# Altium schematic sheet seccionamento.SchDoc: Seccionamento
size A4; Author: Matheus Gois Vieira; Organization: UnB; Address1: Faculdade do Gama
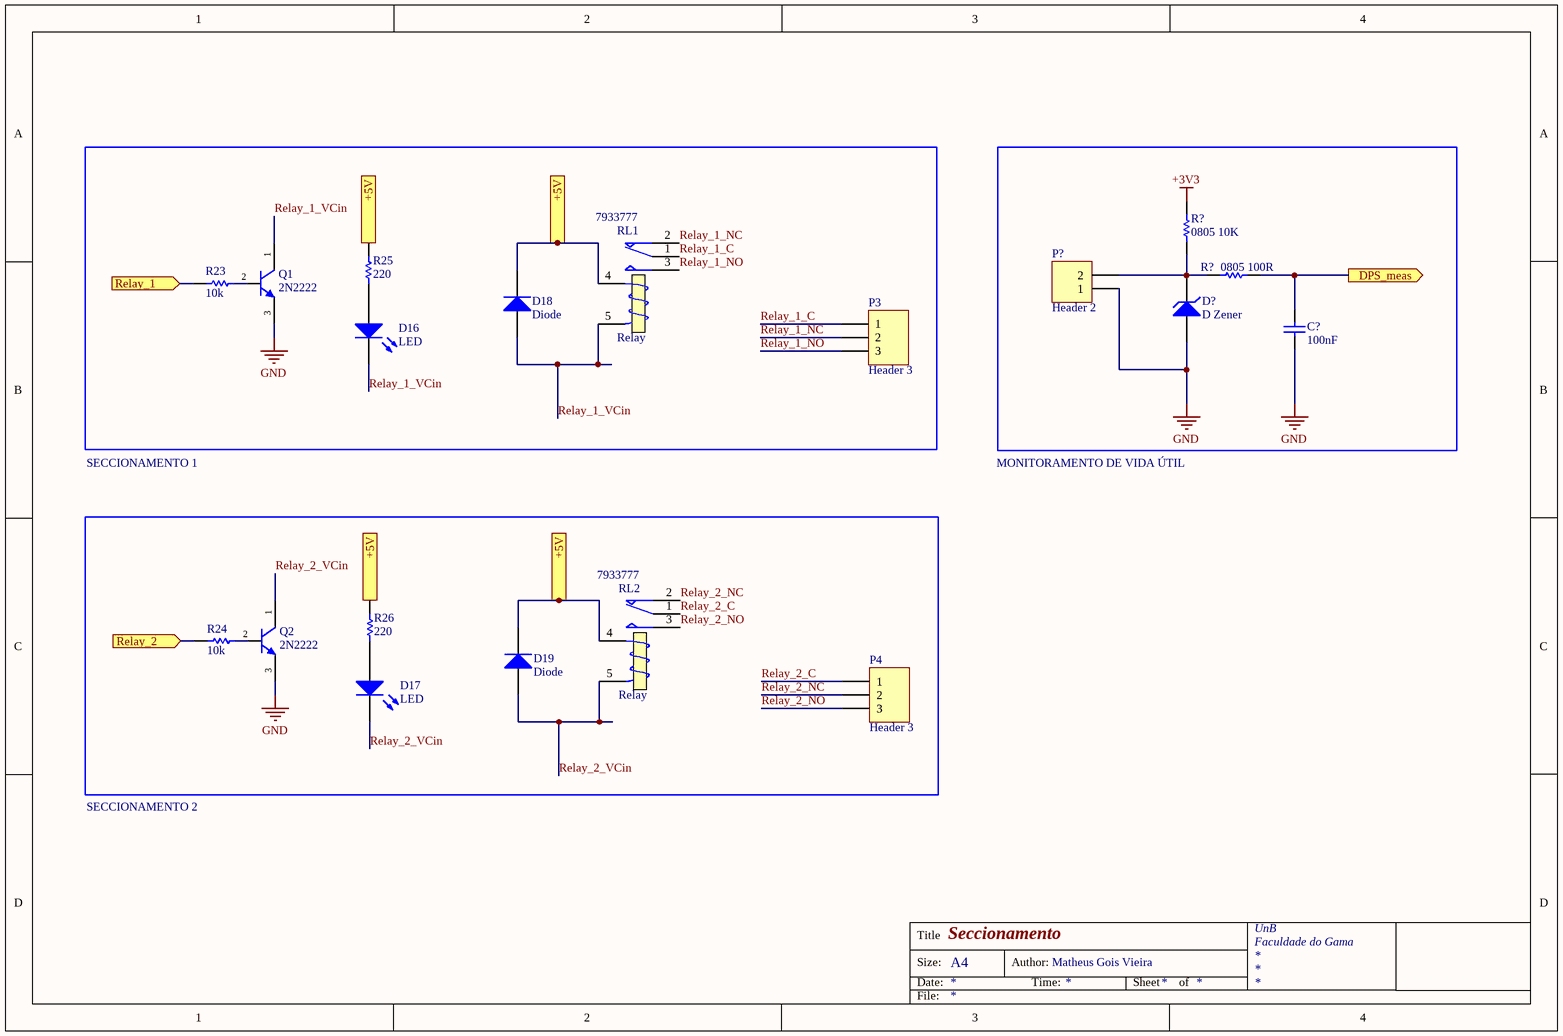
[diagram p0: seccionamento.SchDoc]

## Parts
(Parts that share a designator on the sheet are numbered #1, #2 ... from top to bottom, then left to right.)
C?  100nF  [0603]
D16  LED  [LED-0603-G]
D17  LED  [LED-0603-G]
D18  Diode  [SMC]
D19  Diode  [SMC]
D?  D Zener  [DIODE-SIGNAL]
P3  Header 3  [HDR1X3]
P4  Header 3  [HDR1X3]
P?  Header 2  [HDR1X2]
Q1  2N2222  [TO-220]
Q2  2N2222  [TO-220]
R23  10k  [R1608[0603]]
R24  10k  [R1608[0603]]
R25  220  [R1608[0603]]
R26  220  [R1608[0603]]
R?#1  0805 10K  [RES0805]
R?#2  0805 100R  [RES0805]
RL1  Relay  Supplier Part Number 1: 7933777  [FINDER-36.11]
RL2  Relay  Supplier Part Number 1: 7933777  [FINDER-36.11]

## Ports
+5V (in), DPS_meas (out), Relay_1 (in), Relay_2 (in)

## Nets
+3V3: R?#1.2
GND: C?.2 D?.1(A) P?.1 Q1.3(E) Q2.3(E)
+5V: D18.2(K) D19.2(K) R25.2 R26.2 RL1.4(T1) RL2.4(T1) ; port +5V
DPS_meas: C?.1 R?#2.2 ; port DPS_meas
Relay_1: R23.1 ; port Relay_1
Relay_1_C: P3.1 RL1.1(COM)
Relay_1_NC: P3.2 RL1.2(NC)
Relay_1_NO: P3.3 RL1.3(NO)
Relay_1_VCin: D16.2(K) D18.1(A) Q1.1(C) RL1.5(T2)
Relay_2: R24.1 ; port Relay_2
Relay_2_C: P4.1 RL2.1(COM)
Relay_2_NC: P4.2 RL2.2(NC)
Relay_2_NO: P4.3 RL2.3(NO)
Relay_2_VCin: D17.2(K) D19.1(A) Q2.1(C) RL2.5(T2)
NetD16_1: D16.1(A) R25.1
NetD17_1: D17.1(A) R26.1
NetD?_2: D?.2(K) P?.2 R?#1.1 R?#2.1
NetQ1_2: Q1.2(B) R23.2
NetQ2_2: Q2.2(B) R24.2

## Notes on the sheet
- SECCIONAMENTO 1
- MONITORAMENTO DE VIDA ÚTIL
- SECCIONAMENTO 2
- Title
- Size:
- Date:
- A4
- Author:
- Time:
- Sheet
- of
- File:

## Library data of the parts
C? = CAP CER SMD-0603 100nF - 50V: Capacitor Ceramic 100nF 20% 50V 0603 (1608 Metric) X7R; MPN: C0603C104M5RACTU; Manufacturer: KEMET; CDI: 018177; Op_Temperature: -55 C to +125 C; Type: Capacitor Ceramic; Value: 100nF; Tolerance: 20%; Package: Tape & Reel; RoHS: SIM; Voltage: 50V; Case: 0603 (1608 Metric); Temp_Coefficient: X7R; NCM: *; CDI_Alternate: *; MPN_Alternate: *; Manufacturer_Alternate: *; Price (und.): 0,10000; Price (10k): 0.00741; Supplier 1: RSComponents; Supplier Part Number 1: 6698842
D16 D17 = LED: 0603(H=0.9mm) 绿色 λD=569nm VR=5V VF=2.1V~2.6V IF=20mA PD=100mW; Manufacturer Part Number: LTST-C190GKT; Color: Green; Lens Color: Colorless; Luminous Intensity: 6mcd; Forward Voltage: 2.1V; Viewing Angle: 130°; Lens Style: Clear,Diffused,Colorless,Rectangular; Forward Current: 30mA; Dominant Wavelength: 569nm; Test Current: 10mA; Wavelength: 565nm; Number of LEDs: 1; Power Dissipation: 100mW; Reverse Voltage: 5V; Lens Transparency: Clear; Voltage: 2V; Manufacturer: *; PartNumber: *; Package Type: *; Supplier 1: RSComponents; Supplier Part Number 1: 6920975P; RoHS: Yes; Category: LEDs; Stock 1: 30970; Pricing 1: 250=0,05500, 500=0,05200, 1250=0,03300, 2500=0,03100 (GBP); Mount: Surface Mount; Case/Package: 0603; Number of Pins: 2; Case Code (Metric): 1608; Case Code (Imperial): 0603; Min Operating Temperature: -55°C; Max Operating Temperature: 85°C; Packaging: Tape and Reel; Package Quantity: 1; Illumination Color: Green; Number of Elements: 1; Power Rating: 100mW; Length: 1.6mm; Width: 0.8mm; Height: 0.8mm; Depth: 0.8mm; Radiation Hardening: No; RoHS Compliant: Yes; Lead Free: Lead Free; ComponentLink1URL: https://datasheet.ciiva.com/2109/ltst-c190gkt-2109985.pdf?src-supplier=Digi-Key; ComponentLink1Description: https://datasheet.ciiva.com/2109/ltst-c190gkt-2109985.pdf?src-supplier=Digi-Key; ComponentLink2URL: https://datasheet.ciiva.com/11775/0900766b80dc02a6-11775616.pdf?src-supplier=RSComponents; ComponentLink2Description: https://datasheet.ciiva.com/11775/0900766b80dc02a6-11775616.pdf?src-supplier=RSComponents; ComponentLink3URL: https://datasheet.ciiva.com/12403/lite-on-ltst-c190gkt-187204-12403884.pdf?src-supplier=Mouser; ComponentLink3Description: https://datasheet.ciiva.com/12403/lite-on-ltst-c190gkt-187204-12403884.pdf?src-supplier=Mouser; ComponentLink4URL: https://datasheet.ciiva.com/16392/lite-on20ltst-c190gkt-16392818.pdf?src-supplier=Future+Electronics; ComponentLink4Description: https://datasheet.ciiva.com/16392/lite-on20ltst-c190gkt-16392818.pdf?src-supplier=Future+Electronics; ComponentLink5URL: https://datasheet.ciiva.com/2109/ltst-c190gkt-2109986.pdf?src-supplier=Digi-Key; ComponentLink5Description: https://datasheet.ciiva.com/2109/ltst-c190gkt-2109986.pdf?src-supplier=Digi-Key; ComponentLink6URL: https://datasheet.ciiva.com/2109/ltst-c190gkt-2109987.pdf?src-supplier=Digi-Key; ComponentLink6Description: https://datasheet.ciiva.com/2109/ltst-c190gkt-2109987.pdf?src-supplier=Digi-Key
D18 D19 = Diode: VR=100V IF=200mA; Manufacturer: ON Semiconductor / Fairchild; Manufacturer Part Number: FDLL4148; Polarity: Standard; Max Reverse Current: 5uA; Max Repetitive Reverse Voltage (Vrrm): 100V; Element Configuration: Single; Current Rating: 200mA; Forward Voltage: 1V; Max Forward Surge Current (Ifsm): 4A; Capacitance: 4pF; Power Dissipation: 500mW; Recovery Time: 4ns; Published: 8-Jun-2000; LatestRevisionDate: 17-Jul-2002; LatestRevisionNote: Re-released for DXP Platform.; PackageVersion: Sep-1996; PackageReference: SMC; Publisher: Altium Limited; PackageDescription: DO-214-AB/SMC; 2 C-Bend Leads; Body 7.9 x 5.9 mm, inc. leads (LxW); Code_JEDEC: DO-214-AB; Supplier 1: RSComponents; Supplier Part Number 1: 6708823; RoHS: Yes; Category: Rectifier Diodes; Stock 1: 2100; Pricing 1: 25=0,09200, 500=0,08700, 625=0,08300, 1250=0,07800, 2500=0,07500 (GBP); Mount: Surface Mount; Number of Pins: 34; Weight: 0.05184g; Contact Plating: Tin,Matte; Min Operating Temperature: -65°C; Max Operating Temperature: 175°C; Packaging: Tape and Reel; Package Quantity: 1; Voltage Rating (DC): 100V; Peak Non-Repetitive Surge Current: 4A; Output Current: 200mA; Max Surge Current: 4A; Average Rectified Current: 200mA; Max Reverse Voltage (DC): 100V; Forward Current: 200mA; Reverse Voltage: 100V; Reverse Recovery Time: 4ns; Length: 3.6mm; Width: 1.5mm; Height: 1.5mm; Radiation Hardening: No; RoHS Compliant: Yes; Lead Free: Lead Free; REACH SVHC: No SVHC; ComponentLink1URL: https://datasheet.ciiva.com/34301/785354-34301524.pdf?src-supplier=Jameco; ComponentLink1Description: https://datasheet.ciiva.com/34301/785354-34301524.pdf?src-supplier=Jameco; ComponentLink2URL: https://datasheet.ciiva.com/8053/30071-8053638.pdf?src-supplier=Element14; ComponentLink2Description: https://datasheet.ciiva.com/8053/30071-8053638.pdf?src-supplier=Element14; ComponentLink3URL: https://datasheet.ciiva.com/22714/1716967-22714318.pdf?src-supplier=Element14; ComponentLink3Description: https://datasheet.ciiva.com/22714/1716967-22714318.pdf?src-supplier=Element14; ComponentLink4URL: https://datasheet.ciiva.com/1181/1716967-1181018.pdf?src-supplier=Element14; ComponentLink4Description: https://datasheet.ciiva.com/1181/1716967-1181018.pdf?src-supplier=Element14; ComponentLink5URL: https://datasheet.ciiva.com/1180/1716967-1180972.pdf?src-supplier=Element14; ComponentLink5Description: https://datasheet.ciiva.com/1180/1716967-1180972.pdf?src-supplier=Element14; ComponentLink6URL: https://datasheet.ciiva.com/910/fdll4148-910350.pdf?src-supplier=Digi-Key; ComponentLink6Description: https://datasheet.ciiva.com/910/fdll4148-910350.pdf?src-supplier=Digi-Key; ComponentLink7URL: https://datasheet.ciiva.com/910/fdll4148-910351.pdf?src-supplier=Digi-Key; ComponentLink7Description: https://datasheet.ciiva.com/910/fdll4148-910351.pdf?src-supplier=Digi-Key; ComponentLink8URL: https://datasheet.ciiva.com/910/fdll4148-910349.pdf?src-supplier=Digi-Key; ComponentLink8Description: https://datasheet.ciiva.com/910/fdll4148-910349.pdf?src-supplier=Digi-Key
D? = D Zener: Diode Zener Single 9.1V 5% 500mW 2-Pin(1+Tab) Power Mite T/R; Manufacturer Part Number: 1PMT5924BT1G; Test Current: 41.2mA; Max Power Dissipation: 3.2W; Impedance: 4R; Max Reverse Leakage Current: 5uA; Voltage Rating (DC): 6.2V; ESD Protection: Yes; Manufacturer: *; PartNumber: *; Package Type: *; Supplier 1: Newark; Supplier Part Number 1: 70K6994; RoHS: Yes; Category: Zener Diodes; Pricing 1: 1=0,25500, 3000=0,25500, 9000=0,23200, 24000=0,21400, 45000=0,20000 (USD); Case/Package: DO-216AA; Number of Pins: 2; Contact Plating: Tin,Matte; Min Operating Temperature: -55°C; Max Operating Temperature: 150°C; Packaging: Tape and Reel; Zener Voltage: 9.1V; Voltage Tolerance: 5%; Power Dissipation: 500mW; Element Configuration: Single; Package Quantity: 1; Tolerance: 5%; Power Rating: 3.2W; Breakdown Voltage: 6.2V; Length: 2.18mm; Width: 2.05mm; Height: 1.15mm; Radiation Hardening: No; Lead Free: Lead Free; RoHS Compliant: Yes; Halogen Free: Halogen Free; ComponentLink1URL: https://datasheet.ciiva.com/4735/1pmt5920b-d-40129-4735077.pdf?src-supplier=Mouser; ComponentLink1Description: https://datasheet.ciiva.com/4735/1pmt5920b-d-40129-4735077.pdf?src-supplier=Mouser; ComponentLink2URL: https://datasheet.ciiva.com/26092/1pmt5920b-d-26092383.pdf?src-supplier=Avnet+Europe; ComponentLink2Description: https://datasheet.ciiva.com/26092/1pmt5920b-d-26092383.pdf?src-supplier=Avnet+Europe; ComponentLink3URL: https://datasheet.ciiva.com/10638/1pmt5920b-d-10638985.pdf?src-supplier=Avnet; ComponentLink3Description: https://datasheet.ciiva.com/10638/1pmt5920b-d-10638985.pdf?src-supplier=Avnet
P3 P4 = Header 3: Conn Terminal Block 3 POS 5mm Solder ST Thru-Hole 15A Bulk; Manufacturer: Lumberg; Manufacturer Part Number: KRESS03; Max Supply Voltage (AC): 250V; Number of Poles: 3; Approvals: UL,CSA,VDE; LatestRevisionDate: 17-Jul-2002; LatestRevisionNote: Re-released for DXP Platform.; Publisher: Altium Limited; Supplier 1: RSComponents; Supplier Part Number 1: 2508732301; RoHS: Yes; Category: Connectors; Housing Material: Polyamide; Min Operating Temperature: -25°C; Max Operating Temperature: 100°C; Packaging: Bulk; Number of Rows: 1; Max Current Rating: 15A; Termination: Solder; Orientation: Straight; Current Rating: 15A; Voltage Rating: 250V; Length: 15mm; Depth: 8.3mm; RoHS Compliant: Yes; ComponentLink1URL: https://www.alliedelec.com/m/d/febd0e8d7554432b76be7d34941e766f.pdf?src-supplier=Allied+Electronics; ComponentLink1Description: https://www.alliedelec.com/m/d/febd0e8d7554432b76be7d34941e766f.pdf?src-supplier=Allied+Electronics; ComponentLink2URL: http://components.arrow.com/part/dataview/0323_01039480?src-supplier=Arrow+Europe; ComponentLink2Description: http://components.arrow.com/part/dataview/0323_01039480?src-supplier=Arrow+Europe
P? = Header 2: 间距5.08mm 2pin 母座 12A 320V 弯插 封边; Manufacturer: Phoenix Contact; Manufacturer Part Number: 1757242; Number of Positions: 2; Voltage Rating: 250V; Connector Type: Plug; Gender: Male; Number of Levels: 1; Current: 15A; Voltage: 300V; Pitch: 5.08mm; Approvals: UL,CSA,VDE,EN; LatestRevisionDate: 17-Jul-2002; LatestRevisionNote: Re-released for DXP Platform.; Publisher: Altium Limited; Supplier 1: RSComponents; Supplier Part Number 1: 1896105; RoHS: Yes; Category: Terminal Blocks; Stock 1: 1395; Pricing 1: 5=0,48800, 75=0,44200, 250=0,40400, 500=0,36600, 1000=0,34200 (GBP); Mount: Through Hole; Contact Plating: Tin; Color: Grey,Green; Housing Material: PBT; Contact Material: Tin; Housing Color: Green; Weight: 5.396916oz; Number of Rows: 1; Package Quantity: 50; Packaging: Bulk; Termination: Solder; Number of Contacts: 2; Orientation: Right Angle; Series: MSTBA; Current Rating: 12A; Voltage Rating (DC): 320V; Max Current Rating: 12A; Number of Poles: 2; Number of Positions Per Level: 2; Length: 12.16mm; Width: 12.1mm; Height: 12.08mm; Depth: 12mm; Flammability Rating: UL94 V-0; RoHS Compliant: Yes; REACH SVHC: No SVHC; Lead Free: Lead Free; ComponentLink1URL: https://datasheet.ciiva.com/16096/1757242-16096402.pdf?src-supplier=Onlinecomponents.com; ComponentLink1Description: https://datasheet.ciiva.com/16096/1757242-16096402.pdf?src-supplier=Onlinecomponents.com; ComponentLink2URL: https://datasheet.ciiva.com/15197/getdatasheetpartid-176350-15197328.pdf?src-supplier=Verical; ComponentLink2Description: https://datasheet.ciiva.com/15197/getdatasheetpartid-176350-15197328.pdf?src-supplier=Verical; ComponentLink3URL: https://datasheet.ciiva.com/795/1757242-795407.pdf?src-supplier=Digi-Key; ComponentLink3Description: https://datasheet.ciiva.com/795/1757242-795407.pdf?src-supplier=Digi-Key; ComponentLink4URL: https://datasheet.ciiva.com/29210/569017-da-01-en-grundgehaeuse-1757242-250-st-29210285.pdf?src-supplier=Conrad; ComponentLink4Description: https://datasheet.ciiva.com/29210/569017-da-01-en-grundgehaeuse-1757242-250-st-29210285.pdf?src-supplier=Conrad; ComponentLink5URL: https://datasheet.ciiva.com/7630/100955-7630839.pdf?src-supplier=Element14; ComponentLink5Description: https://datasheet.ciiva.com/7630/100955-7630839.pdf?src-supplier=Element14; ComponentLink6URL: https://datasheet.ciiva.com/33105/1757242-33105868.pdf?src-supplier=Today+Components; ComponentLink6Description: https://datasheet.ciiva.com/33105/1757242-33105868.pdf?src-supplier=Today+Components
Q1 Q2 = NPN: NPN Bipolar Transistor; Manufacturer: *; PartNumber: *; Package Type: *
R23 R24 = R: Res, 10K, 0.01%, 0.25W, 1206, Metal Foil; Manufacturer Part Number: Y163010K0000T9R; Value: 0; Resistance: 10kR; Max Power Dissipation: 250mW; Temperature Coefficient: 0.2ppm/°C; Manufacturer: *; PartNumber: *; Package Type: *; Supplier 1: Digi-Key; Supplier Part Number 1: Y1630-10.0KBCT-ND; RoHS: Yes; Category: Chip SMD Resistors; Stock 1: 1437; Pricing 1: 1=11,40000, 10=10,36300, 25=9,32640, 50=8,03100, 100=7,38340 (USD); Case/Package: 1206; Case Code (Metric): 3216; Case Code (Imperial): 1206; Min Operating Temperature: -55°C; Max Operating Temperature: 150°C; Package Quantity: 1; Packaging: Tape and Reel; Tolerance: 0.01%; Resistor Type: Metal Foil; Number of Terminations: 2; Features: Moisture Resistant,Anti-Sulfur; Length: 0.126inch; Width: 0.062inch; Height: 0.025inch; RoHS Compliant: Yes; ComponentLink1URL: https://datasheet.ciiva.com/29711/vfcpseri-29711161.pdf?src-supplier=Digi-Key; ComponentLink1Description: https://datasheet.ciiva.com/29711/vfcpseri-29711161.pdf?src-supplier=Digi-Key; ComponentLink2URL: https://datasheet.ciiva.com/29711/vfcpseri-29711162.pdf?src-supplier=Digi-Key; ComponentLink2Description: https://datasheet.ciiva.com/29711/vfcpseri-29711162.pdf?src-supplier=Digi-Key; ComponentLink3URL: https://datasheet.ciiva.com/18610/vfcpseri-18610015.pdf?src-supplier=Digi-Key; ComponentLink3Description: https://datasheet.ciiva.com/18610/vfcpseri-18610015.pdf?src-supplier=Digi-Key
R25 R26 = R: Res Thick Film 0603 220 Ohm 1% 1/10W ±100ppm/°C Molded SMD Paper T/R; Manufacturer Part Number: Y163010K0000T9R; Value: 0; Resistance: 10kR; Tolerance: 0.01%; Max Power Dissipation: 250mW; Temperature Coefficient: 0.2ppm/°C; Power Rating: 100mW; Voltage Rating: 50V; Manufacturer: *; PartNumber: *; Package Type: *; RoHS: Yes; Category: Chip SMD Resistors; Stock 1: 11812; Pricing 1: 10=0,01500, 25=0,01200, 50=0,00900, 100=0,00600 (USD); Case/Package: 1206; Case Code (Metric): 3216; Case Code (Imperial): 1206; Min Operating Temperature: -55°C; Max Operating Temperature: 150°C; Package Quantity: 1; Packaging: Tape and Reel; Resistor Type: Metal Foil; Number of Terminations: 2; Features: Moisture Resistant,Anti-Sulfur; Length: 0.126inch; Width: 0.062inch; Height: 0.025inch; RoHS Compliant: Yes; ComponentLink1URL: https://datasheet.ciiva.com/29711/vfcpseri-29711161.pdf?src-supplier=Digi-Key; ComponentLink1Description: https://datasheet.ciiva.com/29711/vfcpseri-29711161.pdf?src-supplier=Digi-Key; ComponentLink2URL: https://datasheet.ciiva.com/29711/vfcpseri-29711162.pdf?src-supplier=Digi-Key; ComponentLink2Description: https://datasheet.ciiva.com/29711/vfcpseri-29711162.pdf?src-supplier=Digi-Key; ComponentLink3URL: https://datasheet.ciiva.com/18610/vfcpseri-18610015.pdf?src-supplier=Digi-Key; ComponentLink3Description: https://datasheet.ciiva.com/18610/vfcpseri-18610015.pdf?src-supplier=Digi-Key; Supplier 1: Newark; Supplier Part Number 1: 82AH6497; Termination: SMD/SMT; Series: AC; ComponentLink4URL: http://www.yageo.com/NewPortal/yageodocoutput?fileName=/pdf/R-Chip/PYu-AC_51_RoHS_L_6.pdf&src-supplier=Mouser; ComponentLink4Description: http://www.yageo.com/NewPortal/yageodocoutput?fileName=/pdf/R-Chip/PYu-AC_51_RoHS_L_6.pdf&src-supplier=Mouser; ComponentLink5URL: http://www.yageo.com/NewPortal/yageodocoutput?fileName=/pdf/R-Chip/PYu-AC_51_RoHS_L_6.pdf&src-supplier=Arrow+Electronics; ComponentLink5Description: http://www.yageo.com/NewPortal/yageodocoutput?fileName=/pdf/R-Chip/PYu-AC_51_RoHS_L_6.pdf&src-supplier=Arrow+Electronics; ComponentLink6URL: http://www.yageo.com/NewPortal/yageodocoutput?fileName=/pdf/R-Chip/PYu-AC_51_RoHS_L_6.pdf&src-supplier=Avnet+Europe; ComponentLink6Description: http://www.yageo.com/NewPortal/yageodocoutput?fileName=/pdf/R-Chip/PYu-AC_51_RoHS_L_6.pdf&src-supplier=Avnet+Europe; ComponentLink7URL: http://www.yageo.com/NewPortal/yageodocoutput?fileName=/pdf/R-Chip/PYu-AC_51_RoHS_L_6.pdf&src-supplier=Digi-Key; ComponentLink7Description: http://www.yageo.com/NewPortal/yageodocoutput?fileName=/pdf/R-Chip/PYu-AC_51_RoHS_L_6.pdf&src-supplier=Digi-Key; ComponentLink8URL: http://www.yageo.com/NewPortal/yageodocoutput?fileName=/pdf/R-Chip/PYu-AC_51_RoHS_L_6.pdf&src-supplier=TTI; ComponentLink8Description: http://www.yageo.com/NewPortal/yageodocoutput?fileName=/pdf/R-Chip/PYu-AC_51_RoHS_L_6.pdf&src-supplier=TTI; ComponentLink9URL: http://www.yageo.com/NewPortal/yageodocoutput?fileName=/pdf/R-Chip/PYu-AC_51_RoHS_L_6.pdf&src-supplier=Schukat; ComponentLink9Description: http://www.yageo.com/NewPortal/yageodocoutput?fileName=/pdf/R-Chip/PYu-AC_51_RoHS_L_6.pdf&src-supplier=Schukat; ComponentLink10URL: http://www.yageo.com/NewPortal/yageodocoutput?fileName=/pdf/R-Chip/PYu-AC_51_RoHS_L_6.pdf&src-supplier=NAC+Semi; ComponentLink10Description: http://www.yageo.com/NewPortal/yageodocoutput?fileName=/pdf/R-Chip/PYu-AC_51_RoHS_L_6.pdf&src-supplier=NAC+Semi; ComponentLink11URL: http://www.yageo.com/NewPortal/yageodocoutput?fileName=/pdf/R-Chip/PYu-AC_51_RoHS_L_6.pdf&src-supplier=Rutronik; ComponentLink11Description: http://www.yageo.com/NewPortal/yageodocoutput?fileName=/pdf/R-Chip/PYu-AC_51_RoHS_L_6.pdf&src-supplier=Rutronik
R?#1 = RC0805FR-0710KL: 10K Omhs 0805 ± 1.00% 0.125W ± 100ppm/℃; Manufacturer: Yageo; Manufacturer Part Number: RC0603FR-0710KL; Tolerance: 1%; Resistance: 10kR; Temperature Coefficient: 100ppm/°C; Voltage Rating: 75V; Voltage Rating (DC): 50V; Power Rating: 100mW; RoHS: Yes; Category: Chip SMD Resistors; Stock 1: 19091268; Pricing 1: 5000=0,00312 (USD); Case/Package: 0603; Number of Pins: 2; Case Code (Imperial): 0603; Case Code (Metric): 1608; Weight: 7.1E-05oz; Size Code: 0603; Min Operating Temperature: -55°C; Max Operating Temperature: 155°C; Resistor Type: Thick Film; Packaging: Tape and Reel; Termination: SMD/SMT; Features: Moisture Resistant; Series: RC; Max Power Dissipation: 100mW; Number of Terminations: 2; Resistance Tolerance: 1%; Construction: Rectangular; Length: 1.6mm; Width: 0.8mm; Height: 0.45mm; Depth: 0.8mm; Lead Pitch: 0.3mm; RoHS Compliant: Yes; REACH SVHC: Unknown; Military Standard: Not; Lead Free: Lead Free; ComponentLink1URL: https://datasheet.ciiva.com/7660/38590-7660789.pdf?src-supplier=Element14; ComponentLink1Description: https://datasheet.ciiva.com/7660/38590-7660789.pdf?src-supplier=Element14; ComponentLink2URL: https://datasheet.ciiva.com/7983/443971-7983596.pdf?src-supplier=Element14; ComponentLink2Description: https://datasheet.ciiva.com/7983/443971-7983596.pdf?src-supplier=Element14; ComponentLink3URL: https://datasheet.ciiva.com/22747/443971-22747519.pdf?src-supplier=Element14; ComponentLink3Description: https://datasheet.ciiva.com/22747/443971-22747519.pdf?src-supplier=Element14; ComponentLink4URL: https://datasheet.ciiva.com/46440/1868787-46440891.pdf?src-supplier=Element14; ComponentLink4Description: https://datasheet.ciiva.com/46440/1868787-46440891.pdf?src-supplier=Element14; ComponentLink5URL: https://datasheet.ciiva.com/7746/1738695-7746239.pdf?src-supplier=Element14; ComponentLink5Description: https://datasheet.ciiva.com/7746/1738695-7746239.pdf?src-supplier=Element14; ComponentLink6URL: https://datasheet.ciiva.com/15189/getdatasheetpartid-409289-15189591.pdf?src-supplier=Verical; ComponentLink6Description: https://datasheet.ciiva.com/15189/getdatasheetpartid-409289-15189591.pdf?src-supplier=Verical; Stock 2: 435000; Pricing 2: 5000=0,00700 (USD); Package Quantity: 1; Technology: THICK FILM; ComponentLink7URL: https://datasheet.ciiva.com/11808/0900766b8106beab-11808151.pdf?src-supplier=RSComponents; ComponentLink7Description: https://datasheet.ciiva.com/11808/0900766b8106beab-11808151.pdf?src-supplier=RSComponents; ComponentLink8URL: https://datasheet.ciiva.com/46447/444164-46447563.pdf?src-supplier=Element14; ComponentLink8Description: https://datasheet.ciiva.com/46447/444164-46447563.pdf?src-supplier=Element14; ComponentLink9URL: https://datasheet.ciiva.com/2456/pyu-r-int-thick-7-2456973.pdf?src-supplier=Digi-Key; ComponentLink9Description: https://datasheet.ciiva.com/2456/pyu-r-int-thick-7-2456973.pdf?src-supplier=Digi-Key; ComponentLink10URL: https://datasheet.ciiva.com/2456/pyu-r-int-thick-7-2456974.pdf?src-supplier=Digi-Key; ComponentLink10Description: https://datasheet.ciiva.com/2456/pyu-r-int-thick-7-2456974.pdf?src-supplier=Digi-Key; ComponentLink11URL: https://datasheet.ciiva.com/2456/pyu-r-int-thick-7-2456972.pdf?src-supplier=Digi-Key; ComponentLink11Description: https://datasheet.ciiva.com/2456/pyu-r-int-thick-7-2456972.pdf?src-supplier=Digi-Key; ComponentLink12URL: https://datasheet.ciiva.com/12669/rc0805-12669688.pdf?src-supplier=Mouser; ComponentLink12Description: https://datasheet.ciiva.com/12669/rc0805-12669688.pdf?src-supplier=Mouser; ComponentLink13URL: https://datasheet.ciiva.com/16747/rc0805-16747087.pdf?src-supplier=Future+Electronics; ComponentLink13Description: https://datasheet.ciiva.com/16747/rc0805-16747087.pdf?src-supplier=Future+Electronics; Supplier 1: RSComponents; Supplier Part Number 1: 6185163
R?#2 = RC0805FR-07100RL: 100R ± 1.00% 0.125W ± 100ppm/℃ 0805; Manufacturer: Yageo; Tolerance: 1%; Voltage Rating (DC): 150V; Temperature Coefficient: 100ppm/°C; Power Rating: 125mW; Application(s): HIGH RELIABILITY; Supplier 1: RSComponents; Manufacturer Part Number: RC0805FR-07100RL; RoHS: Yes; Category: Chip SMD Resistors; Stock 1: 45000; Pricing 1: 5000=0,00700 (USD); Case/Package: 0805; Number of Pins: 2; Case Code (Imperial): 0805; Case Code (Metric): 2012; Weight: 0.000917oz; Min Operating Temperature: -55°C; Max Operating Temperature: 155°C; Resistance: 100R; Packaging: Cut Tape; Resistor Type: Thick Film; Voltage Rating: 150V; Package Quantity: 5000; Termination: SMD/SMT; Number of Terminations: 2; Max Power Dissipation: 125mW; Features: Moisture Resistant; Type: General Purpose; Series: RC; Technology: THICK FILM; Length: 2mm; Width: 1.25mm; Height: 0.5mm; Depth: 1.25mm; Lead Pitch: 0.4mm; REACH SVHC: Unknown; Lead Free: Lead Free; Military Standard: Not; RoHS Compliant: Yes; ComponentLink1URL: https://datasheet.ciiva.com/11808/0900766b8106beab-11808877.pdf?src-supplier=RSComponents; ComponentLink1Description: https://datasheet.ciiva.com/11808/0900766b8106beab-11808877.pdf?src-supplier=RSComponents; ComponentLink2URL: https://datasheet.ciiva.com/7941/1697719-7941680.pdf?src-supplier=Element14; ComponentLink2Description: https://datasheet.ciiva.com/7941/1697719-7941680.pdf?src-supplier=Element14; ComponentLink3URL: https://datasheet.ciiva.com/7941/1686128-7941679.pdf?src-supplier=Element14; ComponentLink3Description: https://datasheet.ciiva.com/7941/1686128-7941679.pdf?src-supplier=Element14; ComponentLink4URL: https://datasheet.ciiva.com/7660/38627-7660797.pdf?src-supplier=Element14; ComponentLink4Description: https://datasheet.ciiva.com/7660/38627-7660797.pdf?src-supplier=Element14; ComponentLink5URL: https://datasheet.ciiva.com/22747/444164-22747535.pdf?src-supplier=Element14; ComponentLink5Description: https://datasheet.ciiva.com/22747/444164-22747535.pdf?src-supplier=Element14; ComponentLink6URL: https://datasheet.ciiva.com/46447/444164-46447562.pdf?src-supplier=Element14; ComponentLink6Description: https://datasheet.ciiva.com/46447/444164-46447562.pdf?src-supplier=Element14; ComponentLink7URL: https://datasheet.ciiva.com/2456/pyu-r-int-thick-7-2456988.pdf?src-supplier=Digi-Key; ComponentLink7Description: https://datasheet.ciiva.com/2456/pyu-r-int-thick-7-2456988.pdf?src-supplier=Digi-Key; ComponentLink8URL: https://datasheet.ciiva.com/2456/pyu-r-int-thick-7-2456989.pdf?src-supplier=Digi-Key; ComponentLink8Description: https://datasheet.ciiva.com/2456/pyu-r-int-thick-7-2456989.pdf?src-supplier=Digi-Key; ComponentLink9URL: https://datasheet.ciiva.com/2456/pyu-r-int-thick-7-2456987.pdf?src-supplier=Digi-Key; ComponentLink9Description: https://datasheet.ciiva.com/2456/pyu-r-int-thick-7-2456987.pdf?src-supplier=Digi-Key; ComponentLink10URL: https://datasheet.ciiva.com/17082/rc0805-17082697.pdf?src-supplier=Future+Electronics; ComponentLink10Description: https://datasheet.ciiva.com/17082/rc0805-17082697.pdf?src-supplier=Future+Electronics; Supplier Part Number 1: 6185135
RL1 RL2 = Relay: SPDT PCB Mount Non-Latching Relay Through Hole; 12V dc; Manufacturer Part Number: 36.11.9.012.4011; Contact Current Rating: 10A; Coil Resistance: 400R; Coil Power: 360mW; Switching Capacity: 500W; Test Voltage: 2.5kV; Coil Current: 30mA; Ratings: IP67; Manufacturer: *; Package Type: *; PartNumber: *; Supplier 1: RSComponents; RoHS: Yes; Category: Power Relays; Stock 1: 639; Pricing 1: 1=1,68000, 10=1,56000, 25=1,47000, 50=1,43000, 100=1,32000 (GBP); Mount: PCB; Contact Material: Tin,Silver; Min Operating Temperature: -40°C; Max Operating Temperature: 85°C; Termination: Through Hole; Switching Current: 10A; Throw Configuration: SPDT; Coil Voltage (DC): 12V; Length: 19mm; Width: 15.5mm; Height: 16mm; Depth: 15.5mm; REACH SVHC: No SVHC; RoHS Compliant: Yes; ComponentLink1URL: https://datasheet.ciiva.com/30469/0900766b812a2bcc-30469325.pdf?src-supplier=RSComponents; ComponentLink1Description: https://datasheet.ciiva.com/30469/0900766b812a2bcc-30469325.pdf?src-supplier=RSComponents; ComponentLink2URL: https://datasheet.ciiva.com/22666/1699475-22666502.pdf?src-supplier=Element14; ComponentLink2Description: https://datasheet.ciiva.com/22666/1699475-22666502.pdf?src-supplier=Element14